# Altium schematic sheet StepperMotorLogic.SchDoc
size B
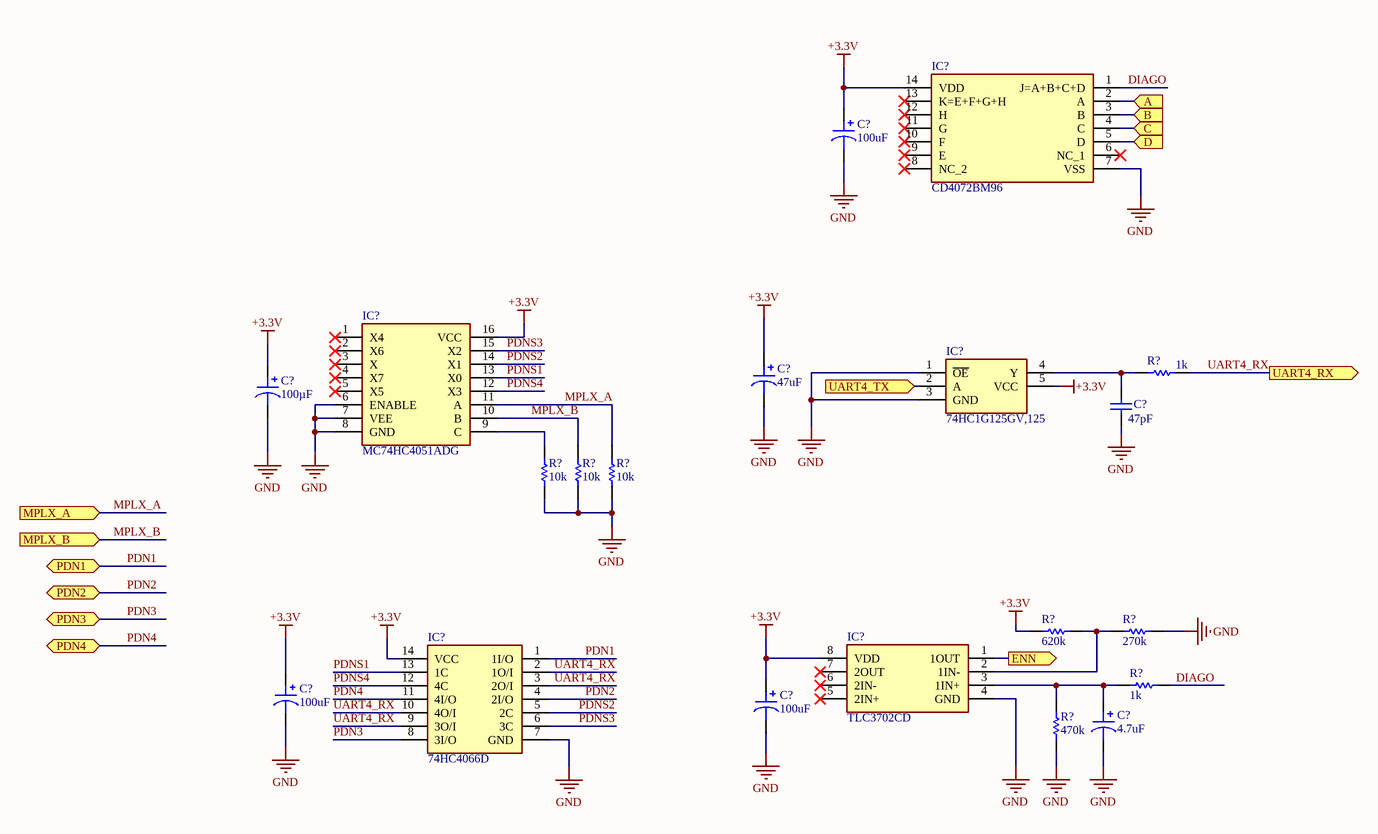
[diagram p0: StepperMotorLogic.SchDoc]

## Parts
(Parts that share a designator on the sheet are numbered #1, #2 ... from top to bottom, then left to right.)
C?#1  100uF  [CAP ALSMD 8.3MM H10.5MM]
C?#2  47uF  [CAP ALSMD 8.3MM H10.5MM]
C?#3  100µF  [CAP ALSMD 8.3MM H10.5MM]
C?#4  value 47pF  [RAD-0.3]  (hidden comment: Cap)
C?#5  100uF  [CAP ALSMD 8.3MM H10.5MM]
C?#6  100uF  [CAP ALSMD 8.3MM H10.5MM]
C?#7  4.7uF  [CAP ALSMD 8.3MM H10.5MM]
IC?#1  CD4072BM96  [SOIC127P600X175-14N]
IC?#2  MC74HC4051ADG  [SOIC127P600X175-16N]
IC?#3  74HC1G125GV,125  [SOT95P275X110-5N]
IC?#4  74HC4066D  [SOIC127P600X175-14N]
IC?#5  TLC3702CD  [SOIC127P600X175-8N]
R?#1  value 1k  [AXIAL-0.3]  (hidden comment: Res1)
R?#2  value 10k  [AXIAL-0.3]  (hidden comment: Res1)
R?#3  value 10k  [AXIAL-0.3]  (hidden comment: Res1)
R?#4  value 10k  [AXIAL-0.3]  (hidden comment: Res1)
R?#5  value 620k  [AXIAL-0.3]  (hidden comment: Res1)
R?#6  value 270k  [AXIAL-0.3]  (hidden comment: Res1)
R?#7  value 1k  [AXIAL-0.3]  (hidden comment: Res1)
R?#8  value 470k  [AXIAL-0.3]  (hidden comment: Res1)

## Ports
A (in), B (in), C (in), D (in), ENN (out), MPLX_A (in), MPLX_B (in), PDN1 (bidir), PDN2 (bidir), PDN3 (bidir), PDN4 (bidir), UART4_RX (out), UART4_TX (in)

## Nets
+3.3V: C?#1.1 C?#2.1 C?#3.1 C?#5.1 C?#6.1 IC?#1.14(VDD) IC?#2.16(VCC) IC?#3.5(VCC) IC?#4.14(VCC) IC?#5.8(VDD) R?#5.2
GND: C?#1.2 C?#2.2 C?#3.2 C?#4.1 C?#5.2 C?#6.2 C?#7.2 IC?#1.7(VSS) IC?#2.6(ENABLE) IC?#2.7(VEE) IC?#2.8(GND) IC?#3.1(~{OE}) IC?#3.3(GND) IC?#4.7(GND) IC?#5.4(GND) R?#2.1 R?#3.1 R?#4.1 R?#6.1 R?#8.1
A: IC?#1.2(A) ; port A
B: IC?#1.3(B) ; port B
C: IC?#1.4(C) ; port C
D: IC?#1.5(D) ; port D
DIAGO: IC?#1.1(J=A+B+C+D) R?#7.2
ENN: IC?#5.1(1OUT) ; port ENN
MPLX_A: IC?#2.11(A) R?#4.2 ; port MPLX_A
MPLX_B: IC?#2.10(B) R?#3.2 ; port MPLX_B
PDN1: IC?#4.1(1I/O) ; port PDN1
PDN2: IC?#4.4(2I/O) ; port PDN2
PDN3: IC?#4.8(3I/O) ; port PDN3
PDN4: IC?#4.11(4I/O) ; port PDN4
PDNS1: IC?#2.13(X0) IC?#4.13(1C)
PDNS2: IC?#2.14(X1) IC?#4.5(2C)
PDNS3: IC?#2.15(X2) IC?#4.6(3C)
PDNS4: IC?#2.12(X3) IC?#4.12(4C)
UART4_RX: IC?#4.2(1O/I) IC?#4.3(2O/I) IC?#4.9(3O/I) IC?#4.10(4O/I) R?#1.1 ; port UART4_RX
UART4_TX: IC?#3.2(A) ; port UART4_TX
NetC?#4_2: C?#4.2 IC?#3.4(Y) R?#1.2
NetC?#7_1: C?#7.1 IC?#5.3(1IN+) R?#7.1 R?#8.2
NetIC?#2_9: IC?#2.9(C) R?#2.2
NetIC?#5_2: IC?#5.2(1IN-) R?#5.1 R?#6.2

Not connected (* = marked no-connect by the designer): IC?#1 6(NC_1)* 8(NC_2)* 9(E)* 10(F)* 11(G)* 12(H)* 13(K=E+F+G+H)*; IC?#2 1(X4)* 2(X6)* 3(X)* 4(X7)* 5(X5)*; IC?#5 5(2IN+)* 6(2IN-)* 7(2OUT)*

## Library data of the parts
C?#1 C?#2 C?#5-C?#7 = UUX1V101MNL6GS: CAP ALUM 100UF 20% 35V SMD; manufacturer: Nichicon; Capacitance: 100µF; Lifetime @ Temp.: 2000 Hrs @ 105°C; Polarization: Polar; Ripple Current @ High Frequency: 367.9mA @ 10kHz; Ripple Current @ Low Frequency: 283mA @ 120Hz; Surface Mount Land Size: 0.327" L x 0.327" W (8.30mm x 8.30mm); value: 100µF; Part Number: UUX1V101MNL6GS; Applications: General Purpose; componentlink1description: Datasheet; componentlink1url: http://nichicon-us.com/english/products/pdfs/e-uux.pdf; componentlink2description: DigiKey Link; componentlink2url: http://digikey.com/product-detail/en/nichicon/UUX1V101MNL6GS/493-6276-1-ND/3438789; Device Package: Radial, Can - SMD; Height - Seated (Max): 0.413" (10.50mm); lastupdated: 02.09.2020 01:25:15; Lifecycle Status: Active; Minimum Order: 1; Mounting Type: Surface Mount; Operating Temperature: -55°C ~ 105°C; Package / Case: Radial, Can - SMD; packaging: TapeAndReel; partid: 7565; Part Status: Active; price: 0.19; series: UUX; Size / Dimension: 0.315" Dia (8.00mm); Supplier 1: DigiKey; Supplier Part Number 1: 493-6276-1-ND; Tolerance: ±20%; Voltage - Rated: 35V
C?#3 = UUX1V101MNL6GS: CAP ALUM 100UF 20% 35V SMD; manufacturer: Nichicon; Lifetime @ Temp.: 2000 Hrs @ 105°C; Polarization: Polar; Ripple Current @ High Frequency: 367.9mA @ 10kHz; Ripple Current @ Low Frequency: 283mA @ 120Hz; Surface Mount Land Size: 0.327" L x 0.327" W (8.30mm x 8.30mm); Part Number: UUX1V101MNL6GS; Applications: General Purpose; Capacitance: 100µF; componentlink1description: Datasheet; componentlink1url: http://nichicon-us.com/english/products/pdfs/e-uux.pdf; componentlink2description: DigiKey Link; componentlink2url: http://digikey.com/product-detail/en/nichicon/UUX1V101MNL6GS/493-6276-1-ND/3438789; Device Package: Radial, Can - SMD; Height - Seated (Max): 0.413" (10.50mm); lastupdated: 02.09.2020 01:25:15; Lifecycle Status: Active; Minimum Order: 1; Mounting Type: Surface Mount; Operating Temperature: -55°C ~ 105°C; Package / Case: Radial, Can - SMD; packaging: TapeAndReel; partid: 7565; Part Status: Active; price: 0.19; series: UUX; Size / Dimension: 0.315" Dia (8.00mm); Supplier 1: DigiKey; Supplier Part Number 1: 493-6276-1-ND; Tolerance: ±20%; value: 100µF; Voltage - Rated: 35V
C?#4 = Cap: Capacitor; Published: 8-Jun-2000; LatestRevisionDate: 17-Jul-2002; LatestRevisionNote: Re-released for DXP Platform.; PackageReference: RAD-0.3; Publisher: Altium Limited; PackageDescription: Radial Cap, Thru-Hole; 2 Leads; 0.3 in Pin Spacing
IC?#1 = CD4072BM96: Integrated Circuit; Manufacturer_Name: Texas Instruments; Datasheet Link: http://www.ti.com/lit/gpn/cd4072b; Height: 1.75mm; Manufacturer_Part_Number: CD4072BM96; Mouser Part Number: 595-CD4072BM96; Mouser Price/Stock: https://www.mouser.co.uk/ProductDetail/Texas-Instruments/CD4072BM96?qs=HTr%252BoA4jRimdX2EbrLvk9A%3D%3D; Arrow Part Number: CD4072BM96; Arrow Price/Stock: https://www.arrow.com/en/products/cd4072bm96/texas-instruments?region=nac
IC?#2 = MC74HC4051ADG: Integrated Circuit; Manufacturer_Name: onsemi; Datasheet Link: http://www.onsemi.com/pub/Collateral/MC74HC4051A-D.PDF; Height: 1.75mm; Manufacturer_Part_Number: MC74HC4051ADG; Mouser Part Number: 863-MC74HC4051ADG; Mouser Price/Stock: https://www.mouser.co.uk/ProductDetail/onsemi/MC74HC4051ADG?qs=qg33o%252B8vzFpcQCvHK306Qw%3D%3D; Arrow Part Number: MC74HC4051ADG; Arrow Price/Stock: https://www.arrow.com/en/products/mc74hc4051adg/on-semiconductor?region=europe
IC?#3 = 74HC1G125GV,125: Integrated Circuit; Manufacturer_Name: Nexperia; Datasheet Link: https://assets.nexperia.com/documents/data-sheet/74HC_HCT1G125.pdf; Height: 1.1mm; Manufacturer_Part_Number: 74HC1G125GV,125; Mouser Part Number: 771-HC1G125GV125; Mouser Price/Stock: https://www.mouser.co.uk/ProductDetail/Nexperia/74HC1G125GV125?qs=P62ublwmbi8%2FUHtIGJBBBA%3D%3D; Arrow Part Number: 74HC1G125GV,125; Arrow Price/Stock: https://www.arrow.com/en/products/74hc1g125gv125/nexperia?region=nac
IC?#4 = 74HC4066D: Integrated Circuit; Manufacturer_Name: Toshiba; Datasheet Link: http://toshiba.semicon-storage.com/info/docget.jsp?did=55443&prodName=74HC4066D; Height: 1.75mm; Manufacturer_Part_Number: 74HC4066D; Mouser Part Number: 757-74HC4066D; Mouser Price/Stock: https://www.mouser.co.uk/ProductDetail/Toshiba/74HC4066D?qs=xhbEVWpZdWfnVpwzPJU8TQ%3D%3D; Arrow Part Number: 74HC4066D; Arrow Price/Stock: https://www.arrow.com/en/products/74hc4066d/toshiba?region=nac
IC?#5 = TLC3702CD: Integrated Circuit; Manufacturer_Name: Texas Instruments; Datasheet Link: http://www.ti.com/lit/ds/symlink/tlc3702.pdf; Height: 1.75mm; Manufacturer_Part_Number: TLC3702CD; Mouser Part Number: 595-TLC3702CD; Mouser Price/Stock: https://www.mouser.co.uk/ProductDetail/Texas-Instruments/TLC3702CD?qs=N6WZOzgtpqUl9Z8VNC%252BKqA%3D%3D; Arrow Part Number: TLC3702CD; Arrow Price/Stock: https://www.arrow.com/en/products/tlc3702cd/texas-instruments?region=nac
R?#1-R?#8 = Res1: Resistor; Published: 8-Jun-2000; LatestRevisionDate: 17-Jul-2002; LatestRevisionNote: Re-released for DXP Platform.; PackageReference: AXIAL-0.3; Publisher: Altium Limited; PackageDescription: Axial Device, Thru-Hole; 2 Leads; 0.3 in Pin Spacing